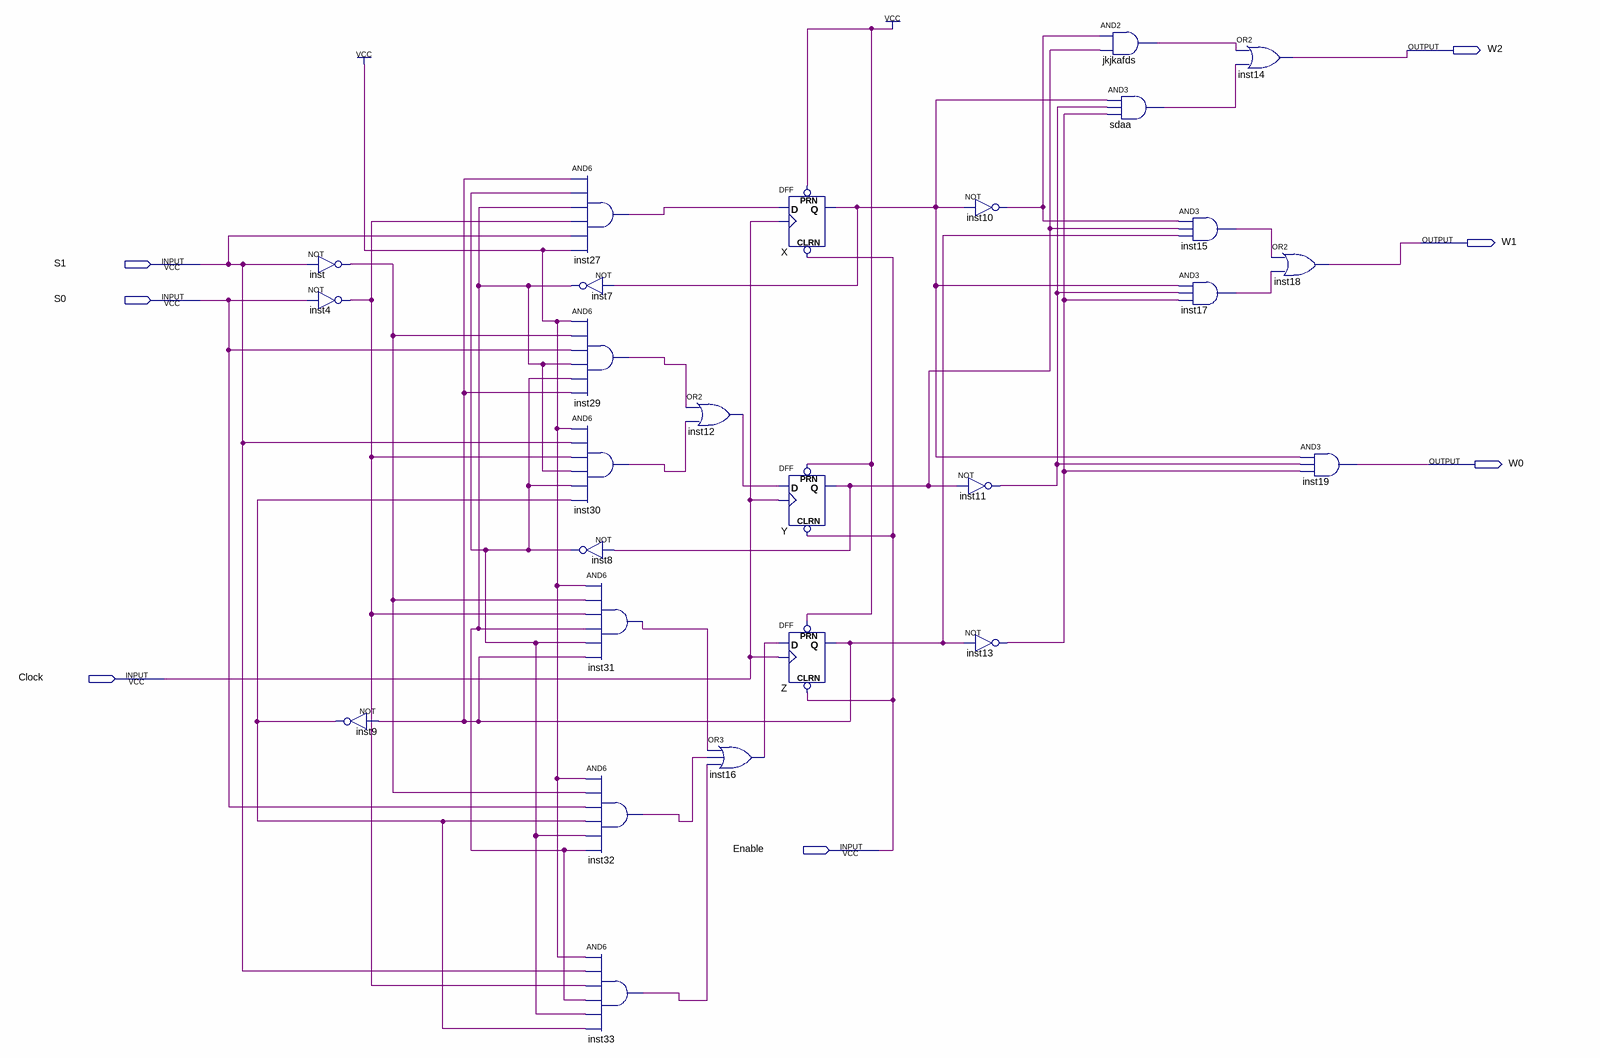
[diagram p0: schematic sheet]
// Quartus schematic fiftyFSM.bdf as structural Verilog: 26 symbols, 7 pins
module fiftyFSM (
  input  S1,
  input  S0,
  input  Clock,
  input  Enable,
  output W2,
  output W1,
  output W0
);

  wire inst4_out, inst7_out, inst8_out, inst9_out, inst10_out, inst11_out, inst12_out, inst13_out,
       inst15_out, inst16_out, inst17_out, inst27_out, inst29_out, inst30_out, inst31_out, inst32_out,
       inst33_out, inst_out, jkjkafds_out, sdaa_out, X_q, Y_q, Z_q;

  not inst (inst_out, S1);
  not inst4 (inst4_out, S0);
  not inst9 (inst9_out, Z_q);
  and inst27 (inst27_out, Z_q, inst8_out, inst7_out, inst4_out, S1, 1'b1);
  not inst7 (inst7_out, X_q);
  and inst29 (inst29_out, 1'b1, inst_out, S0, inst7_out, inst8_out, Z_q);
  and inst30 (inst30_out, 1'b1, S1, inst4_out, inst7_out, inst8_out, inst9_out);
  not inst8 (inst8_out, Y_q);
  and inst31 (inst31_out, 1'b1, inst_out, inst4_out, inst7_out, inst8_out, Z_q);
  and inst32 (inst32_out, 1'b1, inst_out, S0, inst9_out, inst8_out, inst7_out);
  and inst33 (inst33_out, 1'b1, S1, inst4_out, inst7_out, inst8_out, inst9_out);
  or inst12 (inst12_out, inst29_out, inst30_out);
  or inst16 (inst16_out, inst31_out, inst32_out, inst33_out);
  DFF X (.CLRN(Enable), .CLK(Clock), .D(inst27_out), .PRN(1'b1), .Q(X_q));
  DFF Y (.CLRN(Enable), .CLK(Clock), .D(inst12_out), .PRN(1'b1), .Q(Y_q));
  DFF Z (.CLRN(Enable), .CLK(Clock), .D(inst16_out), .PRN(1'b1), .Q(Z_q));
  not inst10 (inst10_out, X_q);
  not inst11 (inst11_out, Y_q);
  not inst13 (inst13_out, Z_q);
  and jkjkafds (jkjkafds_out, inst10_out, Y_q);
  and sdaa (sdaa_out, X_q, inst11_out, inst13_out);
  and inst15 (inst15_out, inst10_out, Y_q, Z_q);
  and inst17 (inst17_out, X_q, inst11_out, inst13_out);
  or inst14 (W2, jkjkafds_out, sdaa_out);
  or inst18 (W1, inst15_out, inst17_out);
  and inst19 (W0, X_q, inst11_out, inst13_out);
endmodule
